# EAGLE design untitled (EAGLE 5.06)
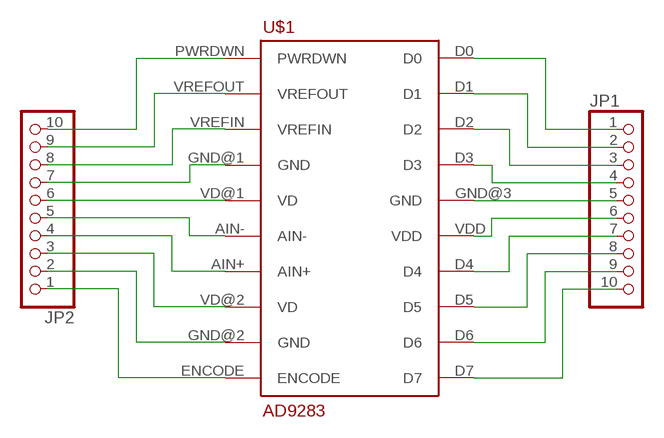
[diagram p0: schematic, sheet 1]

## Parts
JP1  PINHD-1X10  [1X10]
JP2  PINHD-1X10  [1X10]
U$1  AD9283  [RS-20]

## Nets
N$1: JP2.10 U$1.PWRDWN
N$2: JP2.9 U$1.VREFOUT
N$3: JP2.8 U$1.VREFIN
N$4: JP2.7 U$1.GND@1(GND)
N$5: JP2.6 U$1.VD@1(VD)
N$6: JP2.5 U$1.AIN-
N$7: JP2.4 U$1.AIN+
N$8: JP2.3 U$1.VD@2(VD)
N$9: JP2.2 U$1.GND@2(GND)
N$10: JP2.1 U$1.ENCODE
N$11: JP1.10 U$1.D7
N$12: JP1.9 U$1.D6
N$13: JP1.8 U$1.D5
N$14: JP1.7 U$1.D4
N$15: JP1.6 U$1.VDD
N$16: JP1.5 U$1.GND@3(GND)
N$17: JP1.4 U$1.D3
N$18: JP1.3 U$1.D2
N$19: JP1.2 U$1.D1
N$20: JP1.1 U$1.D0

## Library data of the parts
JP1 JP2 = pinhead:PINHD-1X10: PIN HEADER
U$1 = custom-lfc:AD9283

## Board
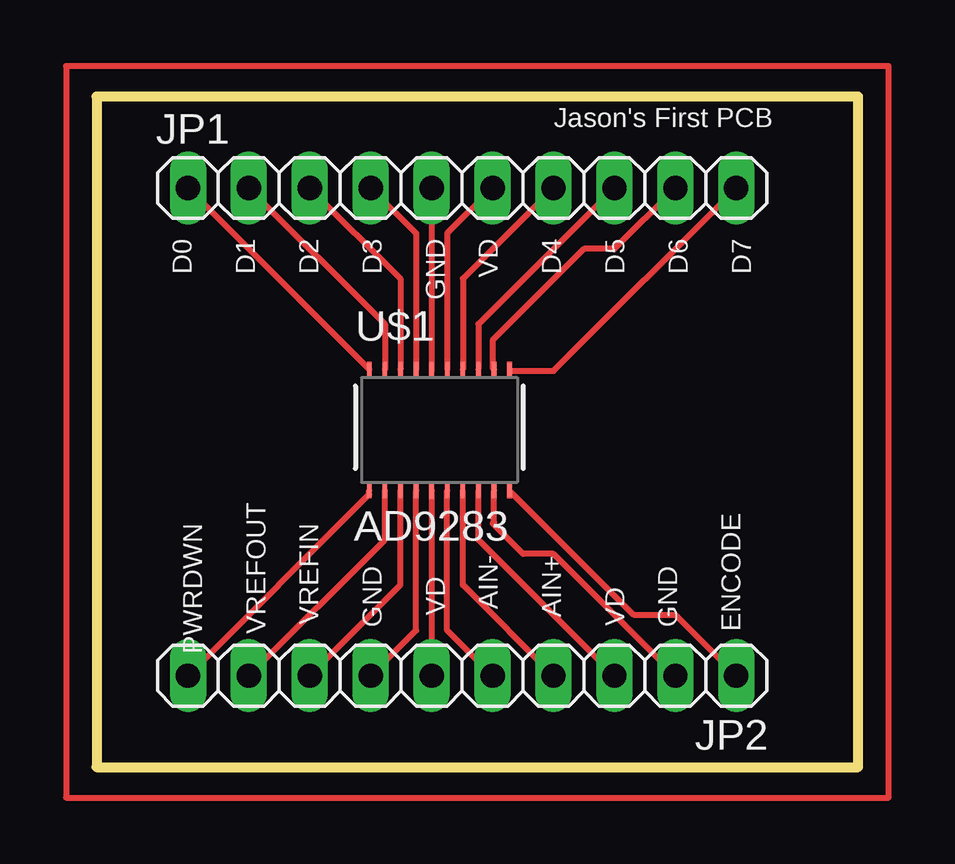
[diagram p1: board, top side]

Size 31.75 x 27.94 mm. Coordinates in mm from the lower left corner, seen from the top.
Outline: 0,27.94 0,0 31.75,0 31.75,27.94 0,27.94
Copper layers (1*16): Top 0.035mm / dielectric 1.5mm / Bottom 0.035mm
Design rules "default": minimum track width 10mil, minimum drill 24mil, track to track 8mil, track to pad 8mil, pad to pad 8mil, via to via 8mil, smd to smd 8mil, copper to edge 40mil, drill to drill 8mil, minimum pad ring 10mil, minimum via ring 8mil, stop-mask expansion 4mil, vias tented up to drill 0mil, thermal gap 10mil

### Footprints (pad centres in the part's own frame; a part is rotated, then mirrored left to right if it is on the bottom)
1X10 = drill 1.016 long: 1 -11.43,0; 2 -8.89,0; 3 -6.35,0; 4 -3.81,0; 5 -1.27,0; 6 1.27,0; 7 3.81,0; 8 6.35,0; 9 8.89,0; 10 11.43,0
RS-20 = smd 0.203 x 0.65: AIN+ 1.3,-2.45; AIN- 0.65,-2.45; D0 -2.6,2.6; D1 -1.95,2.6; D2 -1.3,2.6; D3 -0.65,2.6; D4 1.3,2.6; D5 1.95,2.6; D6 2.6,2.6; D7 3.25,2.6; ENCODE 3.25,-2.45; GND@1 -0.65,-2.45; GND@2 2.6,-2.45; GND@3 0,2.6; PWRDWN -2.6,-2.45; VD@2 1.95,-2.45; VDD 0.65,2.6; VREFIN -1.3,-2.45; VREFOUT -1.95,-2.45 | smd 0.203 x 0.654: VD@1 0,-2.45

### Placement (x,y rotation side)
JP1  15.24,24.13 0 top
JP2  15.24,3.81 180 top
U$1  13.97,13.97 0 top

### Tracks (layer width: path | path; a pad name or v marks a point on that pad's centre or on a via)
N$1
  Top 0.254: JP2.10 11.37,11.37 U$1.PWRDWN
N$2
  Top 0.254: JP2.9 12.02,9.48 U$1.VREFOUT
N$3
  Top 0.254: JP2.8 12.67,7.59 U$1.VREFIN
N$4
  Top 0.254: JP2.7 13.32,5.7 U$1.GND@1
N$5
  Top 0.254: U$1.VD@1 JP2.6
N$6
  Top 0.254: JP2.5 14.62,5.7 U$1.AIN-
N$7
  Top 0.254: JP2.4 15.27,7.59 U$1.AIN+
N$8
  Top 0.254: JP2.3 15.92,9.48 U$1.VD@2
N$9
  Top 0.254: JP2.2 19.05,8.89 17.78,8.89 16.51,10.16 16.57,10.22 U$1.GND@2
N$10
  Top 0.254: U$1.ENCODE 22.39,6.35 24.13,6.35 JP2.1
N$11
  Top 0.254: U$1.D7 17.28,16.51 19.05,16.51 JP1.10
N$12
  Top 0.254: U$1.D6 16.51,16.63 16.51,17.78 20.32,21.59 21.59,21.59 JP1.9 24.01,24.13
N$13
  Top 0.254: JP1.8 15.92,18.46 U$1.D5
N$14
  Top 0.254: JP1.7 15.27,20.35 U$1.D4
N$15
  Top 0.254: JP1.6 14.62,22.24 U$1.VDD
N$16
  Top 0.254: 13.97,16.51 U$1.GND@3 JP1.5
N$17
  Top 0.254: JP1.4 13.32,22.24 U$1.D3
N$18
  Top 0.254: JP1.3 12.67,20.35 U$1.D2
N$19
  Top 0.254: JP1.2 12.02,18.46 U$1.D1
N$20
  Top 0.254: JP1.1 U$1.D0
N$21
  Top 0.254: -1.27,-1.27 33.02,-1.27 33.02,29.21 -1.27,29.21 -1.27,-1.27

### Text on the board
tPlace: Jason's First PCB | D0 | D1 | D2 | D3 | GND | VD | D4 | D5 | D6 | D7 | PWRDWN | VREFOUT | VREFIN | ENCODE | GND | AIN- | AIN+ | GND | VD | VD